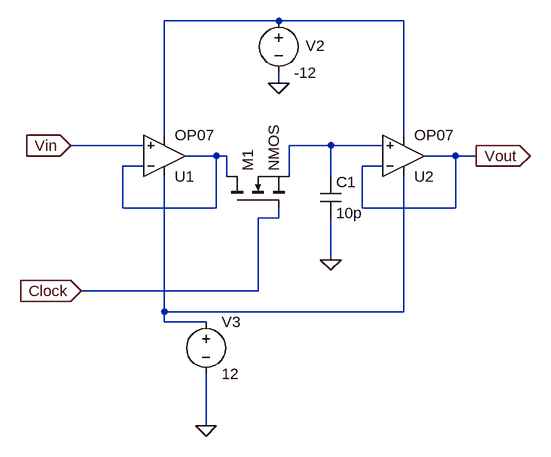
[diagram p0: schematic SH.asc]
SH.asc, the LTspice schematic file:
Version 4
SHEET 1 1452 1236
WIRE 288 -64 112 -64
WIRE 480 -64 288 -64
WIRE 288 32 288 16
WIRE 112 112 112 -64
WIRE 480 112 480 -64
WIRE 80 128 -32 128
WIRE 368 128 304 128
WIRE 448 128 368 128
WIRE 192 144 144 144
WIRE 208 144 192 144
WIRE 560 144 512 144
WIRE 592 144 560 144
WIRE 80 160 48 160
WIRE 448 160 416 160
WIRE 208 176 208 144
WIRE 304 176 304 128
WIRE 368 176 368 128
WIRE 48 224 48 160
WIRE 192 224 192 144
WIRE 192 224 48 224
WIRE 416 224 416 160
WIRE 560 224 560 144
WIRE 560 224 416 224
WIRE 288 240 288 224
WIRE 288 240 256 240
WIRE 368 304 368 240
WIRE 256 352 256 240
WIRE 256 352 -16 352
WIRE 112 384 112 176
WIRE 480 384 480 176
WIRE 480 384 112 384
WIRE 112 400 112 384
WIRE 176 400 112 400
WIRE 176 560 176 480
FLAG 368 304 0
FLAG 592 144 Vout
IOPIN 592 144 Out
FLAG 176 560 0
FLAG 288 32 0
FLAG -32 128 Vin
IOPIN -32 128 In
FLAG -16 352 Clock
IOPIN -16 352 In
SYMBOL cap 352 176 R0
SYMATTR InstName C1
SYMATTR Value 10p
SYMBOL Opamps\\OP07 112 208 M180
SYMATTR InstName U1
SYMBOL Opamps\\OP07 480 208 M180
SYMATTR InstName U2
SYMBOL voltage 288 -80 R0
WINDOW 123 0 0 Left 0
WINDOW 39 0 0 Left 0
WINDOW 0 41 54 Left 2
SYMATTR InstName V2
SYMATTR Value -12
SYMBOL voltage 176 384 R0
WINDOW 123 0 0 Left 0
WINDOW 39 0 0 Left 0
SYMATTR InstName V3
SYMATTR Value 12
SYMBOL nmos 208 224 R270
SYMATTR InstName M1

The netlist it stands for:
* SH.asc
C1 N002 0 10p
XU1 Vin N003 N004 N001 N003 LT1001  ; OP07, pins In+ In- V+ V- OUT
XU2 N002 Vout N004 N001 Vout LT1001  ; OP07, pins In+ In- V+ V- OUT
V2 N001 0 -12
V3 N004 0 12
M1 N003 Clock N002 N002 NMOS
.model NMOS NMOS
.model PMOS PMOS
.lib standard.mos
.lib LTC.lib
.backanno
.end